# Altium schematic sheet Э3.SchDoc: Фильтр 24 / 30 МГц
size 420 x 297 mm; CheckedBy: Бойков; Author: Чалый; CompanyName: РРБО-02-24; DocumentNumber: МРАГ.431122.1300 Э3; SheetNumber: Лист; SheetTotal: 1; PageSetup: Record=PageOptions|CenterHorizontal=True|CenterVertical=True|PrintScale=1.00|XCorrection=1.00|YCorrection=1.00|PrintKind=1|BorderSize=5000000|LeftOffset=0|BottomOffset=0|Orientation=2|PaperLength=1000|PaperWidth=1000|Scale=100|PaperSource=15|PrintQuality=1200|MediaType=1|DitherType=10|PaperKind=A3|PrintScaleMode=1; DocumentType: Схема электрическая принципиальная; FirstReferrence: МРАГ.431122.1200
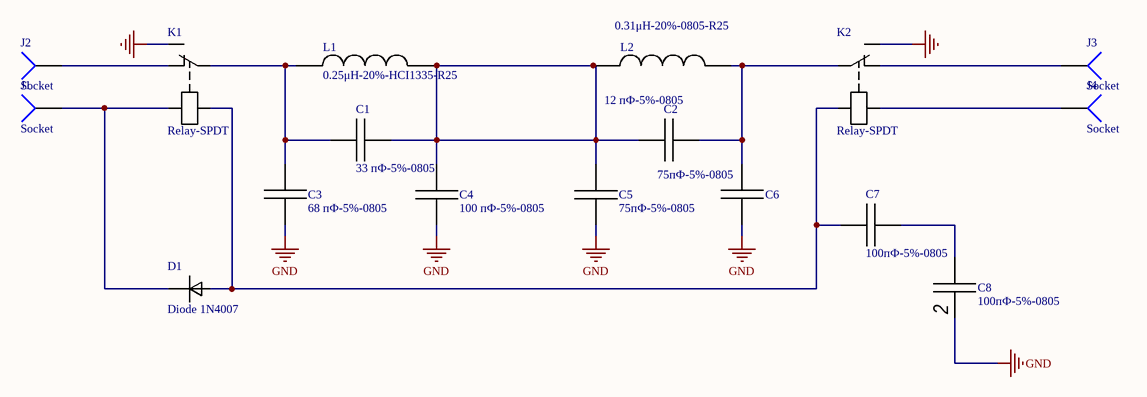
[diagram p0: Э3.SchDoc]

## Parts
C1  33 пФ-5%-0805  [CAPACITOR_SMD0805C]
C2  12 пФ-5%-0805  [CAPACITOR_SMD0805C]
C3  68 пФ-5%-0805  [CAPACITOR_SMD0805C]
C4  100 пФ-5%-0805  [CAPACITOR_SMD0805C]
C5  75пФ-5%-0805  [CAPACITOR_SMD0805C]
C6  75пФ-5%-0805  [CAPACITOR_SMD0805C]
C7  100пФ-5%-0805  [CAPACITOR_SMD0805C]
C8  100пФ-5%-0805  [CAPACITOR_SMD0805C]
D1  Diode 1N4007  [diod]
J1  Socket  [PIN1]
J2  Socket  [PIN1]
J3  Socket  [PIN1]
J4  Socket  [PIN1]
K1  Relay-SPDT  [RALEY_IMO3GR]
K2  Relay-SPDT  [RALEY_IMO3GR]
L1  0.25μH-20%-HCI1335-R25  [INDUCTOR_SMD0805L]
L2  0.31μH-20%-0805-R25  [INDUCTOR_SMD0805L]

## Nets
GND: C3.2 C4.2 C5.2 C6.2 C8.2
NetK1_5: K1.5 K2.1
NetC1_1: C1.1 C3.1 K1.4 L1.1
NetC1_2: C1.2 C2.1 C4.1 C5.1 L1.2 L2.2
NetC2_2: C2.2 C6.1 K2.5 L2.1
NetC7_1: C7.1 D1.1 K1.2 K2.3
NetC7_2: C7.2 C8.1
NetD1_2: D1.2 J1.1 K1.1
NetJ2_1: J2.1 K1.3
NetJ3_1: J3.1 K2.4
NetJ4_1: J4.1 K2.2

## Notes on the sheet
- Перв. примен.
- Справ. №
- Подп. и дата
- Инв. № дубл.
- Взам. инв. №
- Разраб.
- Изм.
- Лист
- № докум.
- Подп.
- Дата
- Лит.
- Масса
- Масштаб
- Пров.
- Т.контр.
- Листов
- Инв. № подл.
- Утв.
- Н.контр.
- 2.106-A3
- Копировал
- Формат А3

## Library data of the parts
C1 = Capacitor_SMD0805C: Manufacturer: Murata Electronics; PartNumber: GRM2165C1H330JA01D; Vlaue: 33 pf-5%-0805; Href: https://www.chipdip.ru/product/grm2165c1h100j?from=suggest_product
C2 = Capacitor_SMD0805C: Manufacturer: Murata Electronics; PartNumber: GRM2195C2D120JV01D; Vlaue: 12 pf-5%-0805; Href: https://www.chipdip.ru/product/grm2165c1h100j?from=suggest_product
C3 = Capacitor_SMD0805C: Manufacturer: Murata Electronics; PartNumber: GRM2165C1H680JZ01D; Vlaue: 68 pf-5%-0805; Href: https://www.chipdip.ru/product/grm2165c1h100j?from=suggest_product
C4 = Capacitor_SMD0805C: Manufacturer: Murata Electronics; PartNumber: GRM2165C1H101JA01D; Vlaue: 100 pf-5%-0805; Href: https://www.chipdip.ru/product/grm2165c1h100j?from=suggest_product
C5 C6 = Capacitor_SMD0805C: Manufacturer: Murata Electronics; PartNumber: GRM2165C1H750JZ01D; Vlaue: 75 pf-5%-0805; Href: https://www.chipdip.ru/product/grm2165c1h100j?from=suggest_product
C7 C8 = Capacitor_SMD0805C: Manufacturer: Murata Electronics; PartNumber: GRM2165C1H101JA01D; Href: 100пФ NPO 50В 5% 0805, GRM2165C1H101J
K1 K2 = Relay-SPDT: Manufacturer: Omron; PartNumber: 8007034659; Href: G5LE-1-12V
L1 = Katushka_SMD0805: Manufacturer: Ferro Core; Href: https://www.tme.eu/en/details/hci1335-r25/inductors/ferrocore/; PartNumber: HCI1335-R25; Value: 0.25μH-20%-HCI1335-R25
L2 = Katushka_SMD0805: Manufacturer: Murata Electronics; Value: 0.31μH-20%-HCI1335-R25; Href: https://www.tme.eu/en/details/hci1335-r25/inductors/ferrocore/; PartNumber: https://www.chipdip.ru/product0/8313487384
D1 = Diode 1N4007: Href: *; Manufacturer: *; PartNumber: *
J1-J4 = Socket: LatestRevisionDate: 17-Jul-2002; LatestRevisionNote: Re-released for DXP Platform.; Publisher: Altium Limited